# EAGLE schematic hdl (EAGLE 9.7.0)
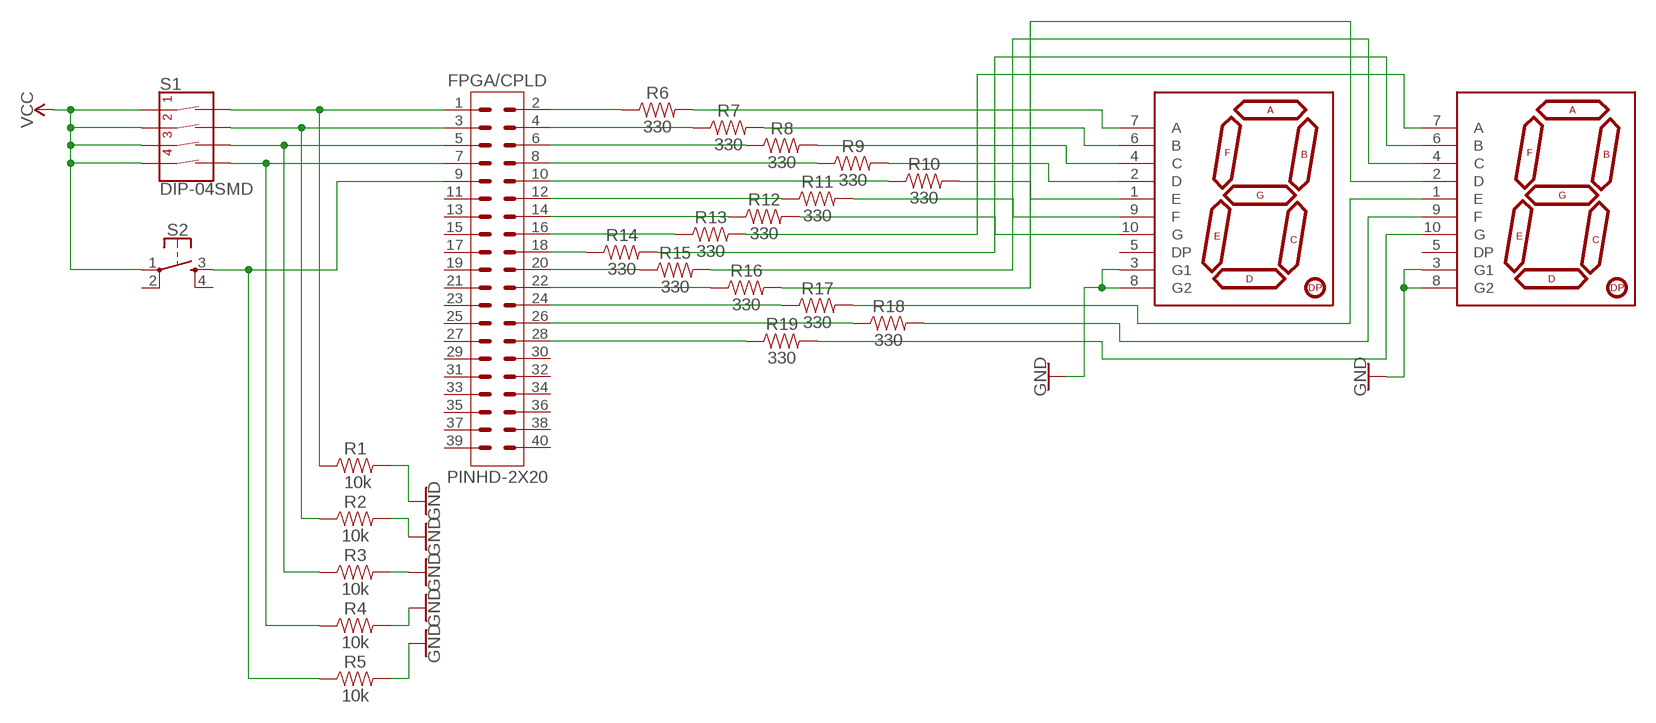
[diagram p0: schematic, sheet 1]

## Parts
FPGA/CPLD  PINHD-2X20  [2X20]
R1  10k  RESISTOR0402  [0402]
R2  10k  RESISTOR0402  [0402]
R3  10k  RESISTOR0402  [0402]
R4  10k  RESISTOR0402  [0402]
R5  10k  RESISTOR0402  [0402]
R6  330  RESISTOR0402  [0402]
R7  330  RESISTOR0402  [0402]
R8  330  RESISTOR0402  [0402]
R9  330  RESISTOR0402  [0402]
R10  330  RESISTOR0402  [0402]
R11  330  RESISTOR0402  [0402]
R12  330  RESISTOR0402  [0402]
R13  330  RESISTOR0402  [0402]
R14  330  RESISTOR0402  [0402]
R15  330  RESISTOR0402  [0402]
R16  330  RESISTOR0402  [0402]
R17  330  RESISTOR0402  [0402]
R18  330  RESISTOR0402  [0402]
R19  330  RESISTOR0402  [0402]
S1  DIP-04SMD  [DIPSWITCH-04-SMD]
S2  MOMENTARY-SWITCH-SPST-2-SMD-4.6X2.8MM  [TACTILE_SWITCH_SMD_4.6X2.8MM]
U$1  YSD-1601AR4B-8  7-SEGMENT-1DIGIT-1INCH-RED-EZ  [7-SEGMENT-1"PTH-EZ]
U$2  YSD-1601AR4B-8  7-SEGMENT-1DIGIT-1INCH-RED-EZ  [7-SEGMENT-1"PTH-EZ]

## Nets
GND: R1.2 R2.2 R3.2 R4.2 R5.2 U$1.3(G1) U$1.8(G2) U$2.3(G1) U$2.8(G2)
N$1: FPGA/CPLD.1 R1.1 S1.1(1A)
N$2: FPGA/CPLD.3 R2.1 S1.2(2A)
N$3: FPGA/CPLD.5 R3.1 S1.3(3A)
N$4: FPGA/CPLD.7 R4.1 S1.4(4A)
N$5: FPGA/CPLD.9 R5.1 S2.3
N$6: FPGA/CPLD.2 R6.1
N$7: FPGA/CPLD.4 R7.1
N$8: FPGA/CPLD.6 R8.1
N$9: FPGA/CPLD.8 R9.1
N$10: FPGA/CPLD.10 R10.1
N$11: FPGA/CPLD.12 R11.1
N$12: FPGA/CPLD.14 R12.1
N$13: FPGA/CPLD.16 R13.1
N$14: FPGA/CPLD.18 R14.1
N$15: FPGA/CPLD.20 R15.1
N$16: FPGA/CPLD.22 R16.1
N$17: FPGA/CPLD.24 R17.1
N$18: FPGA/CPLD.26 R18.1
N$19: FPGA/CPLD.28 R19.1
N$20: R6.2 U$1.7(A)
N$21: R7.2 U$1.6(B)
N$22: R8.2 U$1.4(C)
N$23: R9.2 U$1.2(D)
N$24: R10.2 U$1.1(E)
N$25: R11.2 U$1.9(F)
N$26: R12.2 U$1.10(G)
N$27: R13.2 U$2.7(A)
N$28: R14.2 U$2.6(B)
N$29: R15.2 U$2.4(C)
N$30: R16.2 U$2.2(D)
N$31: R17.2 U$2.1(E)
N$32: R18.2 U$2.9(F)
N$33: R19.2 U$2.10(G)
VCC: S1.5(4B) S1.6(3B) S1.7(2B) S1.8(1B) S2.1
Unconnected: FPGA/CPLD.11 FPGA/CPLD.13 FPGA/CPLD.15 FPGA/CPLD.17 FPGA/CPLD.19 FPGA/CPLD.21 FPGA/CPLD.23 FPGA/CPLD.25 FPGA/CPLD.27 FPGA/CPLD.29 FPGA/CPLD.30 FPGA/CPLD.31 FPGA/CPLD.32 FPGA/CPLD.33 FPGA/CPLD.34 FPGA/CPLD.35 FPGA/CPLD.36 FPGA/CPLD.37 FPGA/CPLD.38 FPGA/CPLD.39 FPGA/CPLD.40 S2.2 S2.4 U$1.5(DP) U$2.5(DP)

## Library data of the parts
FPGA/CPLD = Connector:PINHD-2X20: Pin Header
R1-R19 = SparkFun-Resistors:RESISTOR: Generic Resistor Package
S1 = SparkFun-Switches:DIP-04: 4-Position DIP Switch 4-circuit DIP (dual inline package) switch. Commonly used to physcially set a circuit's behavior. SparkFun Products Prototype Part
S2 = SparkFun-Switches:MOMENTARY-SWITCH-SPST-2: Momentary Switch (Pushbutton) - SPST - Two Circuits Normally-open (NO) SPST momentary switches (buttons, pushbuttons). Schematic symbol includes two switch circuits. Variants SMD-4.6MMX2.8MM - 4.60mm x 2.80mm Tactile Momentary Button Switch - Used on SparkFun Pro Micro - RP2040 <https://www.sparkfun.com/products/17717> SMD-5.2MM - Mini Pushbutton Switch - SMD <https://www.sparkfun.com/products/8720> - Used on Arduino Pro Mini <https://www.sparkfun.com/products/11114>
U$1 U$2 = SparkFun-LED:7-SEGMENT-1DIGIT-1INCH: 7-Segment Display, single digit, 1" EZ is for kits. Pads are only exposed on the bottom side to help prevent soldering in upside down. Datasheet (Red) <https://cdn.sparkfun.com/datasheets/Components/LED/YSD-160AR4B-8.pdf> Datasheet (Blue) <https://cdn.sparkfun.com/datasheets/Components/LED/YSD-160AB3C-8.pdf> SparkFun Products 7-Segment Display - LED (Red) <https://www.sparkfun.com/products/8546> (COM-08546) 7-Segment Display - LED (Blue) <https://www.sparkfun.com/products/9191> (COM-09191)